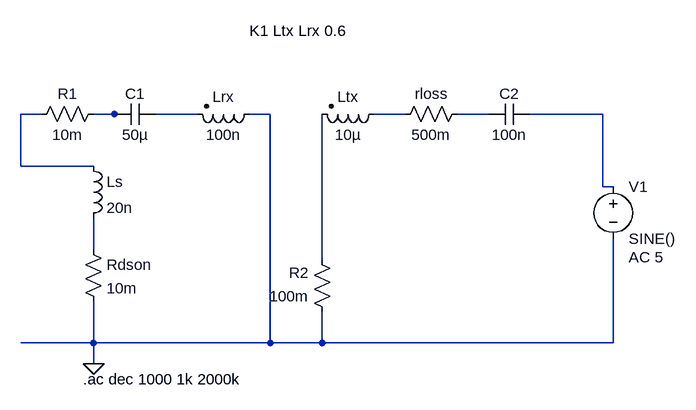
[diagram p0: schematic rds_on.asc]
rds_on.asc, the LTspice schematic file:
Version 4
SHEET 1 2136 680
WIRE -48 0 -80 0
WIRE 64 0 32 0
WIRE 80 0 64 0
WIRE 192 0 128 0
WIRE 304 0 272 0
WIRE 512 0 464 0
WIRE 640 0 592 0
WIRE 816 0 704 0
WIRE -80 80 -80 0
WIRE 32 80 -80 80
WIRE 816 112 816 0
WIRE 832 112 816 112
WIRE 32 208 32 160
WIRE 384 224 384 0
WIRE 32 352 32 288
WIRE 32 352 -80 352
WIRE 304 352 304 0
WIRE 304 352 32 352
WIRE 384 352 384 304
WIRE 384 352 304 352
WIRE 832 352 832 192
WIRE 832 352 384 352
WIRE 32 384 32 352
FLAG 32 384 0
SYMBOL res 16 192 R0
SYMATTR InstName Rdson
SYMATTR Value 10m
SYMBOL ind 16 64 R0
SYMATTR InstName Ls
SYMATTR Value 20n
SYMBOL res 608 -16 R90
WINDOW 0 0 56 VBottom 2
WINDOW 3 32 56 VTop 2
SYMATTR InstName rloss
SYMATTR Value 500m
SYMBOL ind2 288 -16 R90
WINDOW 0 5 56 VBottom 2
WINDOW 3 32 56 VTop 2
SYMATTR InstName Lrx
SYMATTR Value 100n
SYMATTR Type ind
SYMBOL ind2 480 -16 R90
WINDOW 0 5 56 VBottom 2
WINDOW 3 32 56 VTop 2
SYMATTR InstName Ltx
SYMATTR Value 10µ
SYMATTR Type ind
SYMBOL cap 128 -16 R90
WINDOW 0 0 32 VBottom 2
WINDOW 3 32 32 VTop 2
SYMATTR InstName C1
SYMATTR Value 50µ
SYMBOL cap 704 -16 R90
WINDOW 0 0 32 VBottom 2
WINDOW 3 32 32 VTop 2
SYMATTR InstName C2
SYMATTR Value 100n
SYMBOL res 48 -16 R90
WINDOW 0 0 56 VBottom 2
WINDOW 3 32 56 VTop 2
SYMATTR InstName R1
SYMATTR Value 10m
SYMBOL voltage 832 96 R0
WINDOW 123 24 124 Left 2
WINDOW 39 0 0 Left 0
SYMATTR InstName V1
SYMATTR Value SINE()
SYMATTR Value2 AC 5
SYMBOL res 400 320 R180
WINDOW 0 36 76 Left 2
WINDOW 3 36 40 Left 2
SYMATTR InstName R2
SYMATTR Value 100m
TEXT 16 408 Left 2 !.ac dec 1000 1k 2000k
TEXT 272 -128 Left 2 !K1 Ltx Lrx 0.6

The netlist it stands for:
* rds_on.asc
Rdson N007 0 10m
Ls N001 N007 20n
rloss N005 N004 500m
Lrx 0 N003 100n
Ltx N004 N008 10µ
C1 N003 N002 50µ
C2 N006 N005 100n
R1 N002 N001 10m
V1 N006 0 SINE() AC 5
R2 0 N008 100m
.ac dec 1000 1k 2000k
K1 Ltx Lrx 0.6
.backanno
.end